# Altium schematic sheet RS485.SchDoc
size A4; SheetNumber: 4; SheetTotal: 9
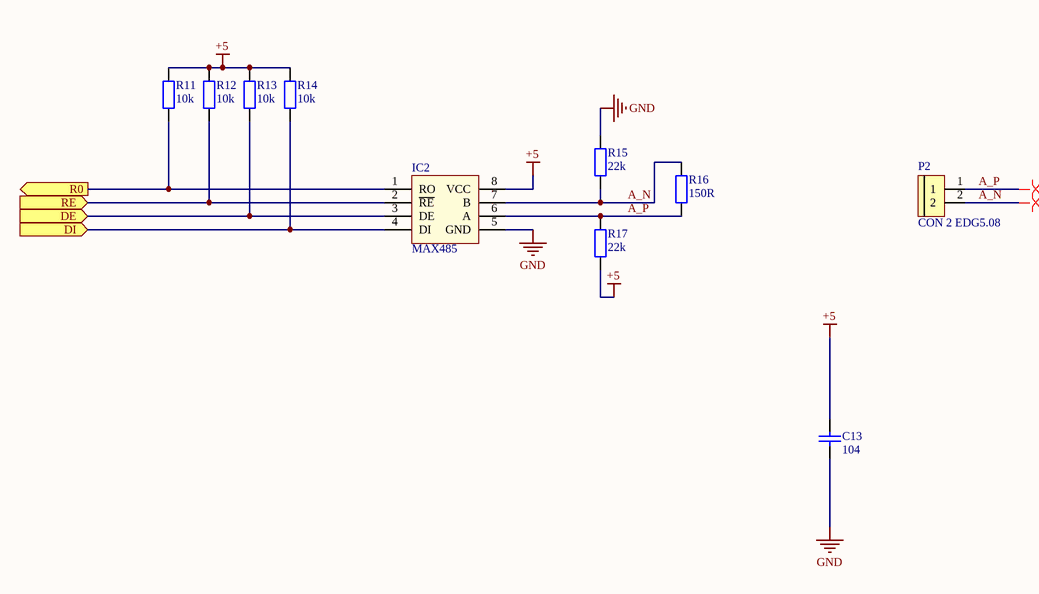
[diagram p0: RS485.SchDoc]

## Parts
C13  104  [tu 0603]
IC2  MAX485  [SO-8]
P2  CON 2 EDG5.08  [CON 2 2EDG5.08]
R11  10k  [tro smd 0603]
R12  10k  [tro smd 0603]
R13  10k  [tro smd 0603]
R14  10k  [tro smd 0603]
R15  22k  [tro smd 0603]
R16  150R  [tro smd 0603]
R17  22k  [tro smd 0603]

## Ports
DE (in), DI (in), R0 (out), RE (in)

## Nets
+5: C13.1 IC2.8(VCC) R11.2 R12.2 R13.2 R14.2 R17.1
GND: C13.2 IC2.5(GND) R15.2
A_N: IC2.7(B) P2.2 R15.1 R16.2
A_P: IC2.6(A) P2.1 R16.1 R17.2
DE: IC2.3(DE) R13.1 ; port DE
DI: IC2.4(DI) R14.1 ; port DI
R0: IC2.1(RO) R11.1 ; port R0
RE: IC2.2(~{RE}) R12.1 ; port RE

## Layout directives
differential pair: A_N, A_P

## Library data of the parts
C13 = Tu 0603 104 50V 10%: Dán; Don_Vi: Con; So_Chan: 2; Ten_Linh_Kien: Tụ 0603 104-100nF 10% 50V; Ma_Hang: MH004568; Chung_Loai: Dán; Kieu_Chan: *
IC2 = MAX485: RS232 - RS485 (Same sn75176)
P2 = CON 2 EDG5.08: Cắm; Ten_Linh_Kien: CON 2 2EDG5.08-2P 5.08MM ( Xanh Cong); Ma_Hang: MH000759; Ghi_Chu: *; Don_Vi: Con; Kieu_Chan: *; Chung_Loai: Cắm
R11-R14 = Tro 0603 1% 10k: Dán; Don_Vi: Con; So_Chan: 2; Ten_Linh_Kien: Trở 0603 1% 10k; Ma_Hang: MH006333; Chung_Loai: Dán; Kieu_Chan: *
R15 R17 = Tro 0603 1% 22k: Dán; Don_Vi: Con; So_Chan: 2; Ten_Linh_Kien: Trở 0603 1% 22k; Ma_Hang: MH005794; Chung_Loai: Dán; Kieu_Chan: *
R16 = Tro 0603 5% 150R: Dán; Don_Vi: Con; So_Chan: 2; Ten_Linh_Kien: Trở 0603 5% 150R; Ma_Hang: MH006318; Chung_Loai: Dán; Kieu_Chan: *